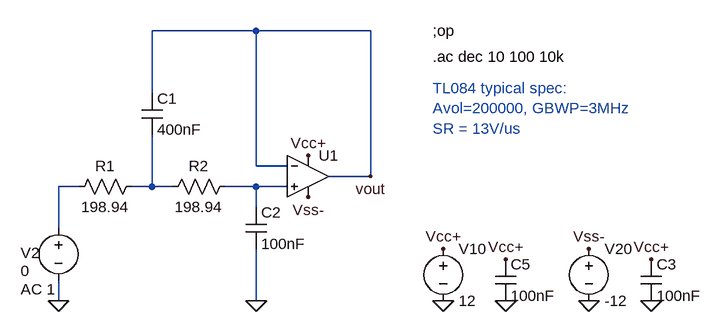
[diagram p0: schematic Lowpass_Filter.asc]
Lowpass_Filter.asc, the LTspice schematic file:
Version 4
SHEET 1 880 680
WIRE -176 -112 -336 -112
WIRE 0 -112 -176 -112
WIRE -336 -16 -336 -112
WIRE -176 96 -176 -112
WIRE -128 96 -176 96
WIRE 0 112 0 -112
WIRE 0 112 -64 112
WIRE -448 128 -480 128
WIRE -336 128 -336 48
WIRE -336 128 -368 128
WIRE -304 128 -336 128
WIRE -176 128 -224 128
WIRE -128 128 -176 128
WIRE -176 160 -176 128
WIRE -480 192 -480 128
WIRE -480 304 -480 272
WIRE -176 304 -176 224
FLAG -480 304 0
FLAG 112 304 0
FLAG 336 304 0
FLAG 112 224 Vcc+
FLAG 336 224 Vss-
FLAG -96 144 Vss-
FLAG -96 80 Vcc+
FLAG 0 112 vout
FLAG -176 304 0
FLAG 208 240 Vcc+
FLAG 208 304 0
FLAG 432 240 Vcc+
FLAG 432 304 0
SYMBOL voltage 112 208 R0
WINDOW 123 0 0 Left 2
WINDOW 39 0 0 Left 2
SYMATTR InstName V10
SYMATTR Value 12
SYMBOL voltage 336 208 R0
WINDOW 123 0 0 Left 2
WINDOW 39 0 0 Left 2
SYMATTR InstName V20
SYMATTR Value -12
SYMBOL Opamps\\UniversalOpamp2 -96 112 R0
SYMATTR InstName U1
SYMATTR Value2 Avol=200000 GBW=3Meg Slew=13Meg
SYMBOL voltage -480 176 R0
WINDOW 0 -58 54 Left 2
WINDOW 3 -58 82 Left 2
WINDOW 123 -58 110 Left 2
WINDOW 39 0 0 Left 2
SYMATTR InstName V2
SYMATTR Value 0
SYMATTR Value2 AC 1
SYMBOL res -352 112 R90
WINDOW 0 0 56 VBottom 2
WINDOW 3 32 56 VTop 2
SYMATTR InstName R1
SYMATTR Value 198.94
SYMBOL res -208 112 R90
WINDOW 0 0 56 VBottom 2
WINDOW 3 32 56 VTop 2
SYMATTR InstName R2
SYMATTR Value 198.94
SYMBOL cap -352 -16 R0
SYMATTR InstName C1
SYMATTR Value 400nF
SYMBOL cap -192 160 R0
SYMATTR InstName C2
SYMATTR Value 100nF
SYMBOL cap 192 240 R0
SYMATTR InstName C5
SYMATTR Value 100nF
SYMBOL cap 416 240 R0
SYMATTR InstName C3
SYMATTR Value 100nF
TEXT 96 -112 Left 2 !;op
TEXT 96 -72 Left 2 !.ac dec 10 100 10k
TEXT 96 -24 Left 2 ;TL084 typical spec:\nAvol=200000, GBWP=3MHz\nSR = 13V/us

The netlist it stands for:
* Lowpass_Filter.asc
V10 Vcc+ 0 12
V20 Vss- 0 -12
XU1 N003 vout Vcc+ Vss- vout level.2 Avol=200000 GBW=3Meg Slew=13Meg ilimit=25m rail=0 Vos=0 phimargin=45 en=0 enk=0 in=0 ink=0 Rin=500Meg  ; pins IN+ IN- V+ V- OUT
V2 N001 0 0 AC 1
R1 N002 N001 198.94
R2 N003 N002 198.94
C1 vout N002 400nF
C2 N003 0 100nF
C5 Vcc+ 0 100nF
C3 Vcc+ 0 100nF
;op
.ac dec 10 100 10k
* TL084 typical spec:
* Avol=200000, GBWP=3MHz
* SR = 13V/us
.lib UniversalOpamps2.sub
.backanno
.end